# Altium schematic sheet Compact Flash Reader2.schdoc
size 292 x 193 mm; SheetNumber: 0; SheetTotal: 0
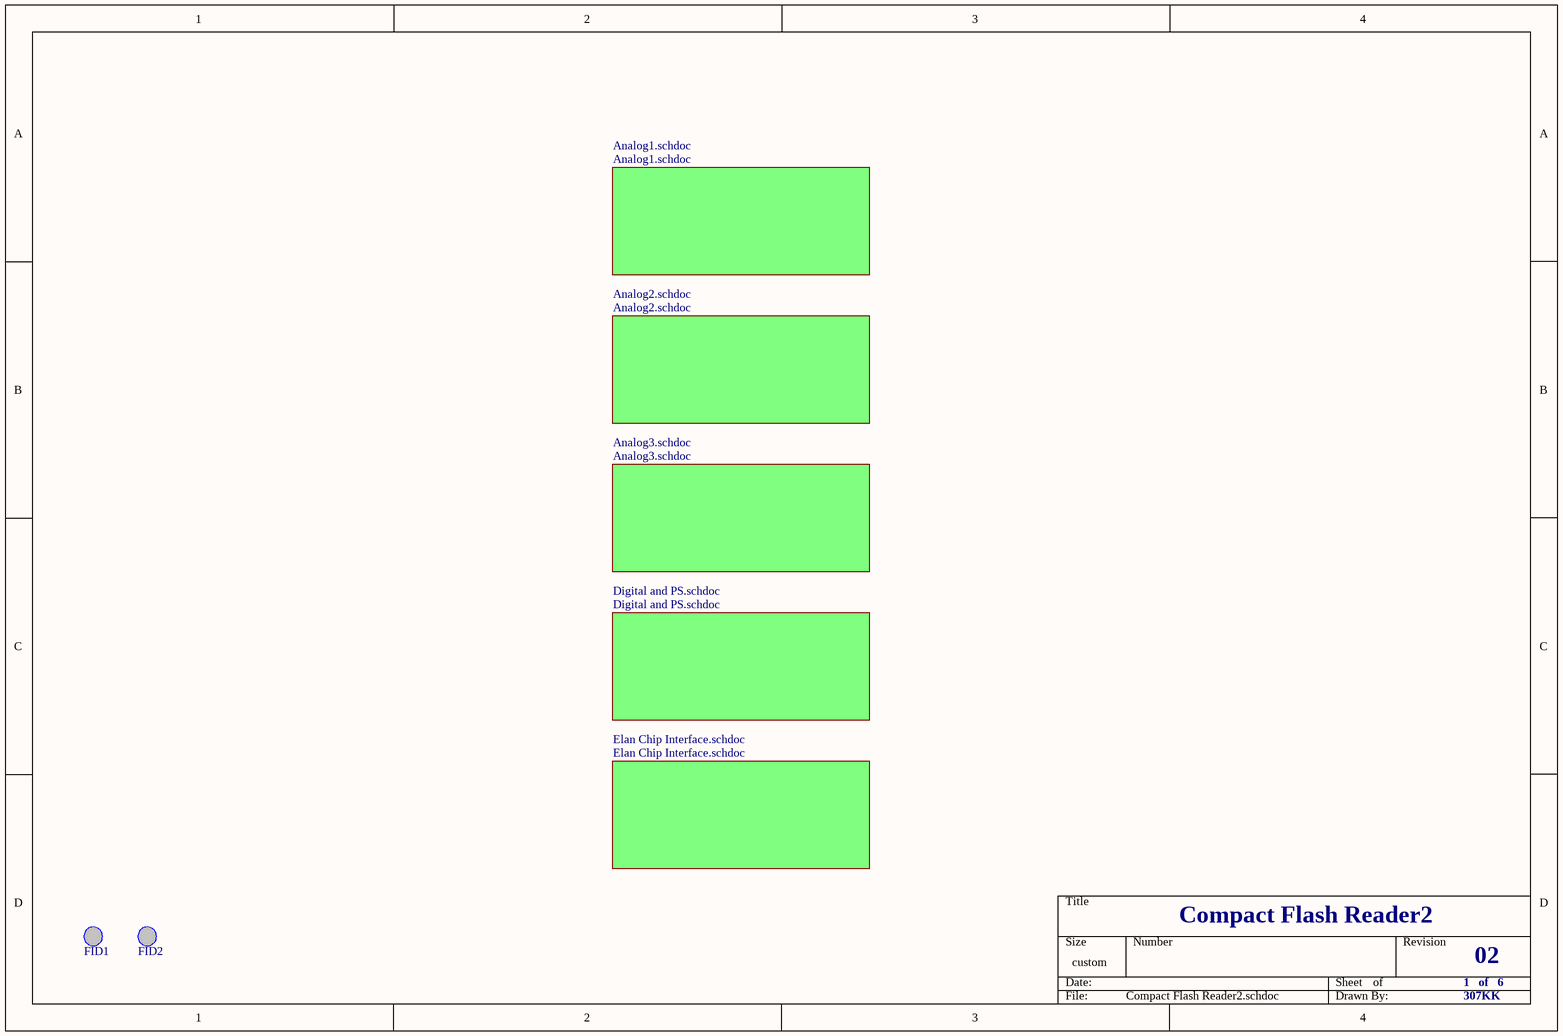
[diagram p0: Compact Flash Reader2.schdoc]

## Parts
FID1  FD  [FiducialOrigin_020205]  (value not drawn)
FID2  FD  [FiducialTwoSide_020205]  (value not drawn)

## Sub-sheets
Analog1.schdoc = Analog1.schdoc: no entries  | Description: Analog1
Analog2.schdoc = Analog2.schdoc: no entries  | Description: Analog2
Analog3.schdoc = Analog3.schdoc: no entries  | Description: Analog3
Digital and PS.schdoc = Digital and PS.schdoc: no entries  | Description: Digital and PS
Elan Chip Interface.schdoc = Elan Chip Interface.schdoc: no entries  | Description: Elan Chip Interface

## Nets

Not connected (* = marked no-connect by the designer): FID1 0; FID2 0

## Notes on the sheet
- Compact Flash Reader2
- 1   of   6
- 02
- 307KK

## Library data of the parts
FID1 FID2 = FiducialOneSide040: PARTNO: N/A; VALUE: N/A